# EasyEDA Pro project PixelClock像素时钟-开源Pix24-O.eprj, schematic Schematic2_16
Create Date: 2024-08-11; Page Name: P1; Project Name: EasyMatrix像素钟_Base; Schematic Name: Schematic2_10; Update Date: 2024-08-11
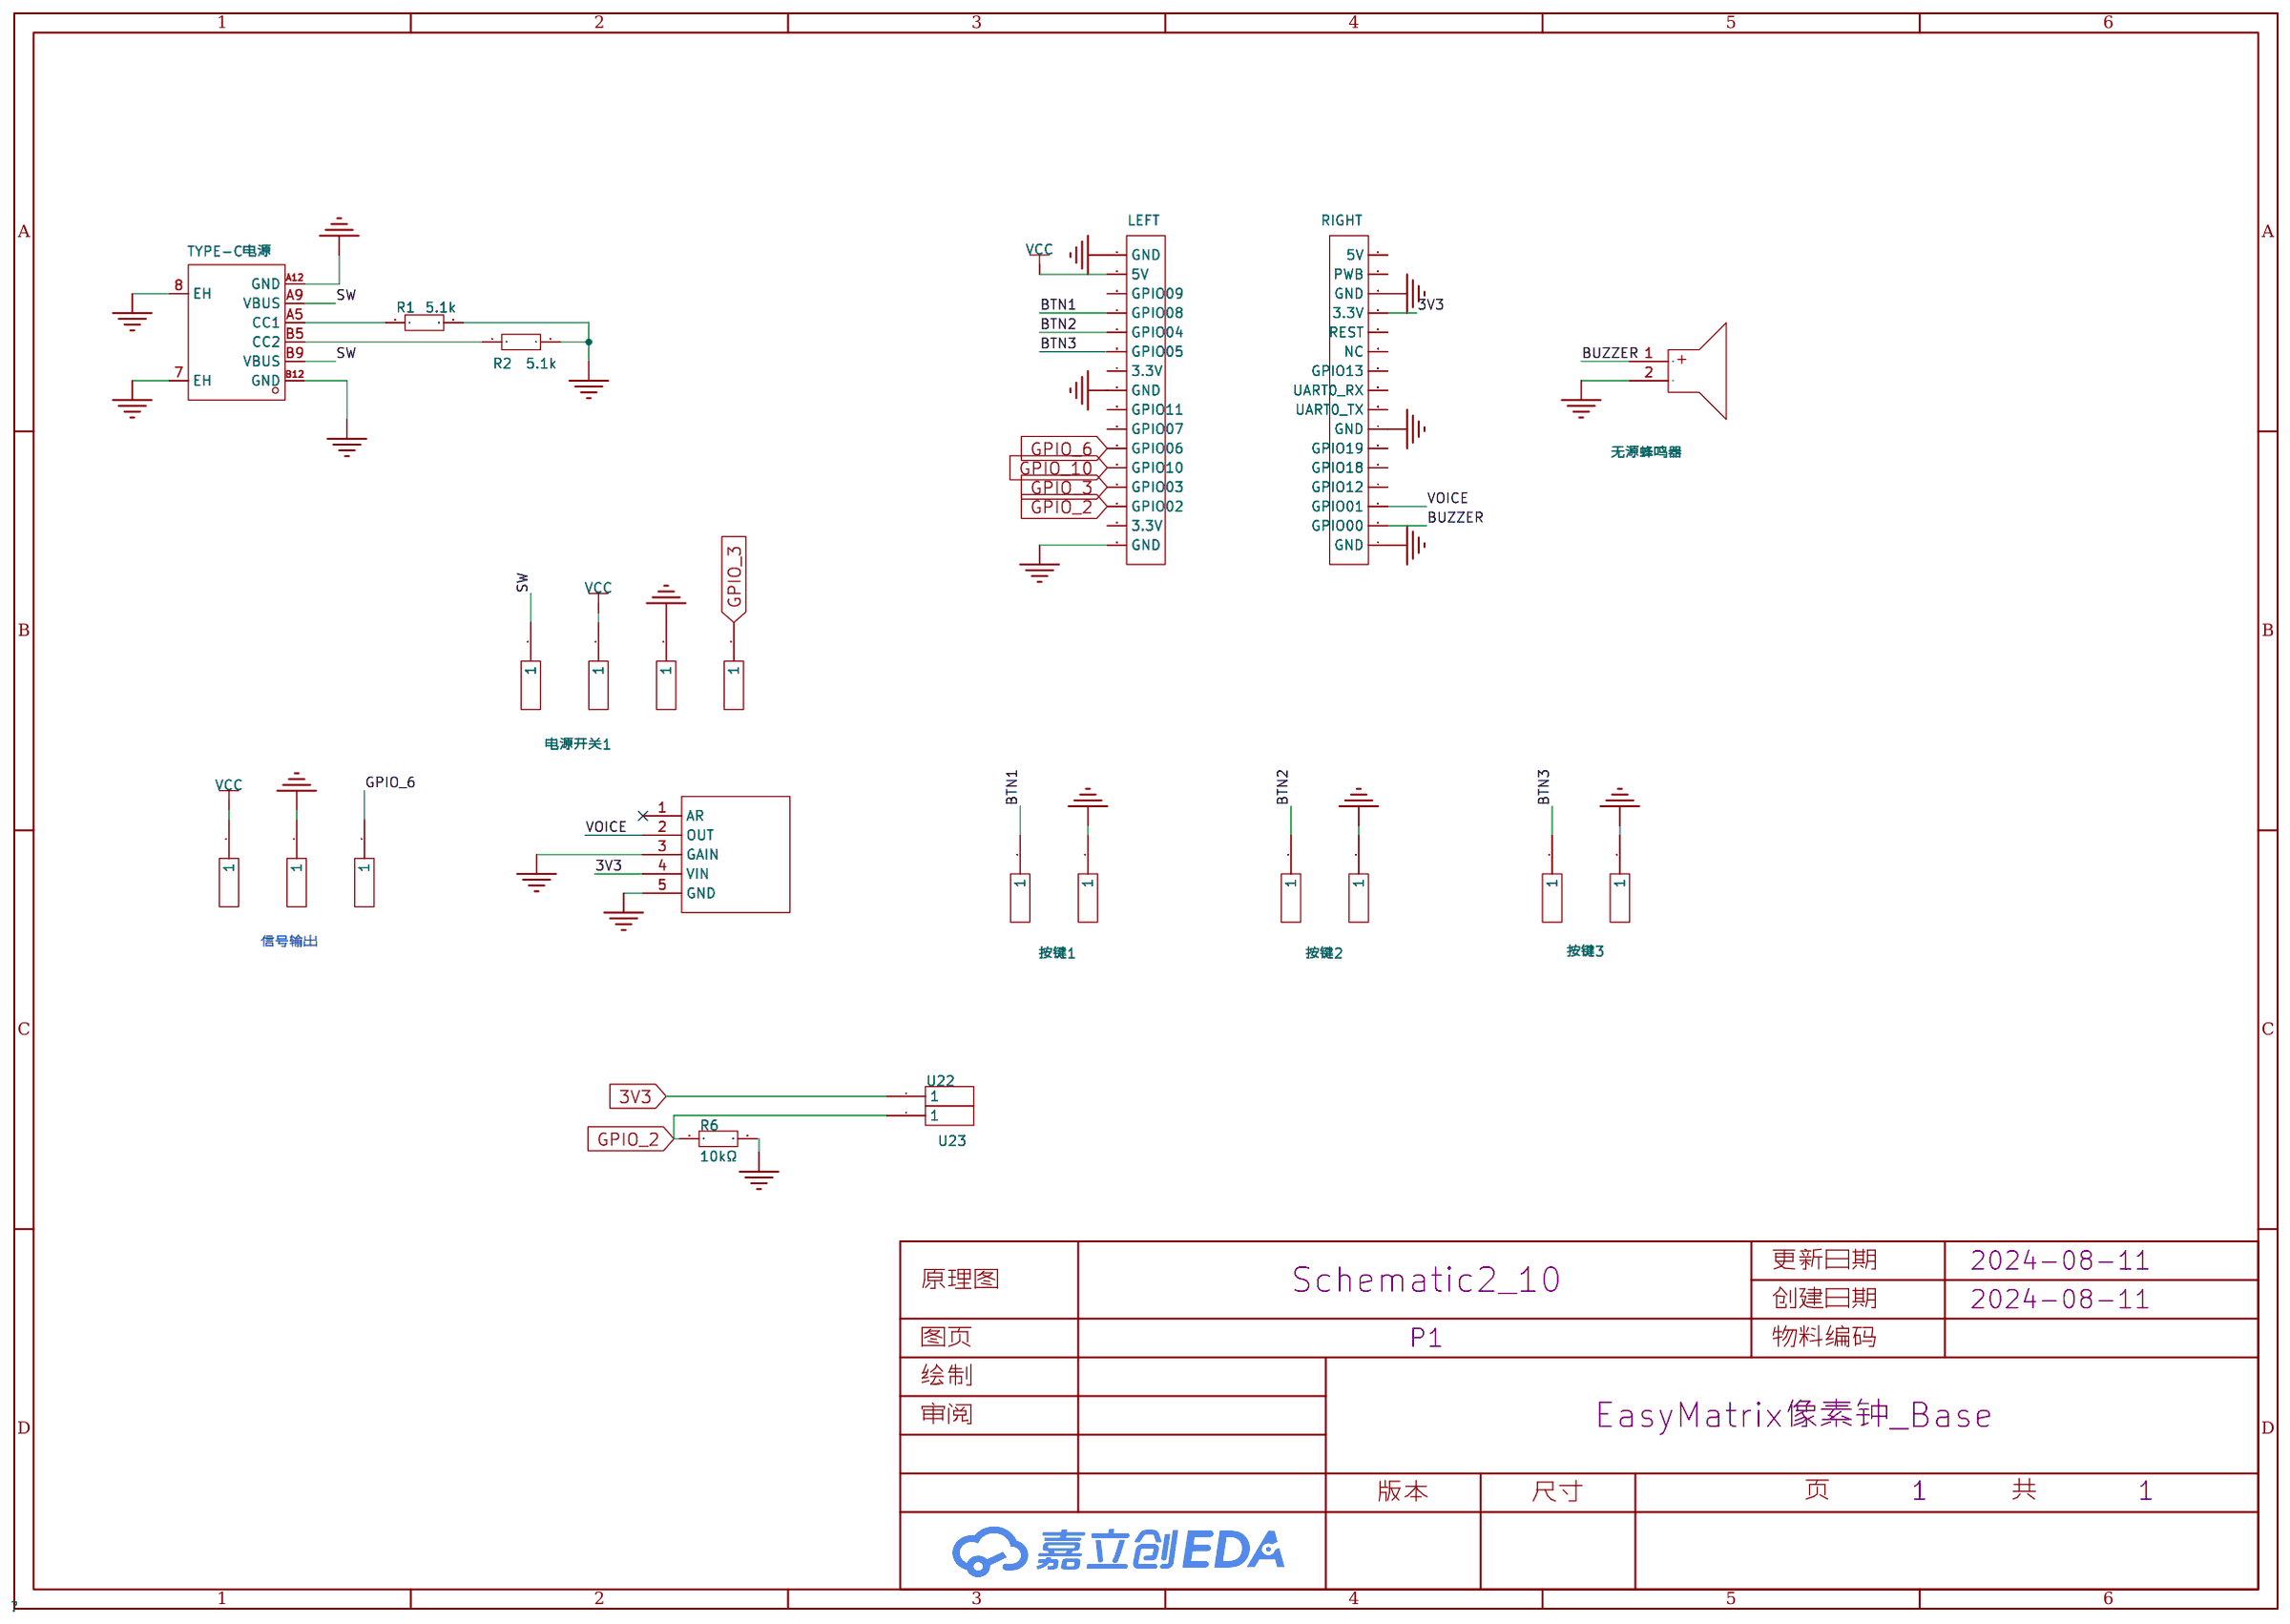
[diagram p1: schematic sheet]

## Parts
LEFT  HDR-F-2.54_1x16  [HDR-F-2.54_1X16]
R1  5.1k  [R0805]
R2  5.1k  [R0805]
R6  10kΩ  [R0805]
RIGHT  HDR-F-2.54_1x16  [HDR-F-2.54_1X16]
TYPE-C电源  TYPE-C 6P LT6.8(073)  [USB-C-SMD_TYPE-C-6P-LT6.8-073]
U6  -  [长圆形单面焊盘]
U8  -  [长圆形单面焊盘]
U10  -  [长圆形单面焊盘]
U15  -  [MAX9814模块]
U16  -  [长圆形单面焊盘]
U17  -  [长圆形单面焊盘]
U18  -  [长圆形单面焊盘]
U19  -  [长圆形单面焊盘]
U20  -  [长圆形单面焊盘]
U21  -  [长圆形单面焊盘]
U22  -  [长圆形单面焊盘]
U23  -  [长圆形单面焊盘]
按键1  -  [长圆形单面焊盘]
按键2  -  [长圆形单面焊盘]
按键3  -  [长圆形单面焊盘]
无源蜂鸣器  无源蜂鸣器  [BUZ-TH_BD12.0-P6.50-D0.6-FD]
电源开关1  -  [长圆形单面焊盘]

## Library data of the parts
LEFT RIGHT = HDR-F-2.54_1x16: Supplier Part: C66987; Supplier: LCSC
R1 R2 = Res_0805: Supplier Footprint: 0805
R6 = 0805W8F1002T5E_C17414: 电阻类型:厚膜电阻;阻值:10kΩ;精度:±1%;功率:125mW;最大工作电压:150V;温度系数:±100ppm/℃;; LCSC Part Name: 10kΩ ±1% 125mW 厚膜电阻; Supplier Part: C17414; Manufacturer: UNI-ROYAL(厚声); Manufacturer Part: 0805W8F1002T5E; Supplier Footprint: 0805; JLCPCB Part Class: 基础库; Datasheet: https://atta.szlcsc.com/upload/public/pdf/source/20200306/C422600_1E6D84923E4A46A82E41ADD87F860B5C.pdf; Supplier: LCSC; Type: 厚膜电阻; Tolerance: ±1%; Power(Watts): 125mW; Overload Voltage (Max): 150V; Temperature Coefficient: ±100ppm/℃; Operating Temperature Range: -55℃~+155℃
TYPE-C电源 = TYPE-C 6P LT6.8(073): 连接器类型:Type-C;标准:-;公母:母;端口数量:1;触点数量:6P;安装方式:立贴;额定电流 - 电源:3A;工作温度范围:-25℃~+85℃;; LCSC Part Name: Type-C 母 立贴; Supplier Part: C2858271; Manufacturer: SHOU HAN(首韩); Supplier Footprint: SMD; JLCPCB Part Class: 扩展库; Supplier: LCSC; Connector Type: Type-C; Gender: 母; Number of Ports: 1; Number of Contacts: 6P; Mounting Style: 立贴; Current Rating - Power (Max): 3A; Operating Temperature Range: -25℃~+85℃
U6 U8 U10 U16-U23 按键1-按键3 电源开关1 = 长圆形单面焊盘
U15 = MAX9814模块: 麦克风放大器; Datasheet: https://github.com/adafruit/Adafruit-MAX9814-AGC-Microphone-PCB
无源蜂鸣器 = YS-MBZ12095C05R42K4000: LCSC Part Name: 蜂鸣器 无源5V42欧4000HZ; Supplier Part: C2891357; Manufacturer: Fengming(锋鸣电子); Supplier Footprint: 插件,P=6.5mm; Datasheet: https://atta.szlcsc.com/upload/public/pdf/source/20210903/1BFBC8824417868F880E44F43CB98B3A.pdf; Supplier: LCSC

## Nets
3V3: RIGHT.13(3.3V) U15.4(VIN) U22.1
GND: LEFT.1(GND) LEFT.8(GND) LEFT.16(GND) R1.2 R2.2 R6.2 RIGHT.1(GND) RIGHT.7(GND) RIGHT.14(GND) TYPE-C电源.7(EH) TYPE-C电源.8(EH) TYPE-C电源.A12(GND) TYPE-C电源.B12(GND) U15.3(GAIN) U15.5(GND) U17.1 U20.1 按键1.1 按键2.1 按键3.1 无源蜂鸣器.2(-)
VCC: LEFT.2(5V) U19.1 电源开关1.1
BTN1: LEFT.4(GPIO08) U6.1
BTN2: LEFT.5(GPIO04) U8.1
BTN3: LEFT.6(GPIO05) U10.1
BUZZER: RIGHT.2(GPIO00) 无源蜂鸣器.1(+)
GPIO_2: LEFT.14(GPIO02) R6.1 U23.1
GPIO_3: LEFT.13(GPIO03) U16.1
GPIO_6: LEFT.11(GPIO06) U21.1
GPIO_10: LEFT.12(GPIO10)
SW: TYPE-C电源.A9(VBUS) TYPE-C电源.B9(VBUS) U18.1
VOICE: RIGHT.3(GPIO01) U15.2(OUT)
$1N4002: R1.1 TYPE-C电源.A5(CC1)
$1N4005: R2.1 TYPE-C电源.B5(CC2)

Not connected (* = marked no-connect by the designer): LEFT 3(GPIO09) 7(3.3V) 9(GPIO11) 10(GPIO07) 15(3.3V); RIGHT 4(GPIO12) 5(GPIO18) 6(GPIO19) 8(UART0_TX) 9(UART0_RX) 10(GPIO13) 11(NC) 12(REST) 15(PWB) 16(5V); U15 1(AR)*

## Notes on the sheet
- 信号输出
